# Altium project Top_Main.PrjPcb
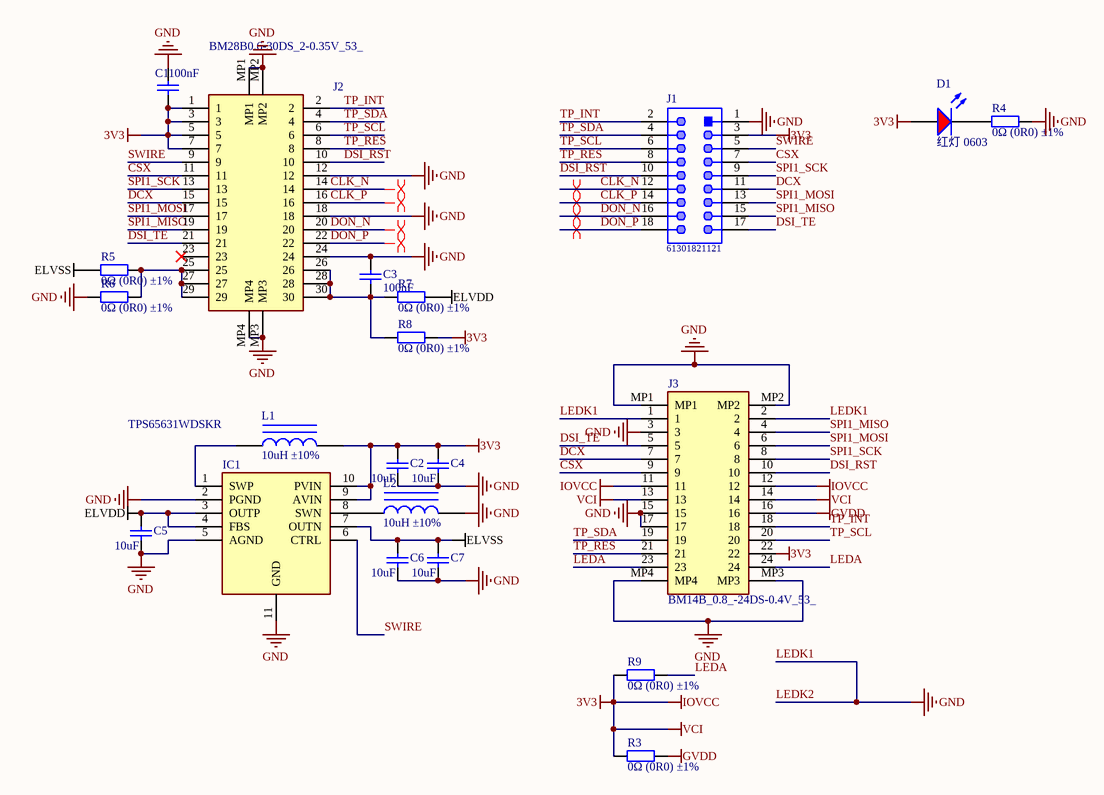
[diagram p0: MIAN.SchDoc]
1 sheet, 21 parts. Net scope: global (net labels, ports and power ports of the same name join across sheets).
Board file: PCB.PcbDoc

## Sheet MIAN.SchDoc
size A4; SheetNumber: 1; SheetTotal: 1

### Parts
C1  100nF  [0402_C]
C2  10uF  [0402_C]
C3  100nF  [0402_C]
C4  10uF  [0402_C]
C5  10uF  [0402_C]
C6  10uF  [0402_C]
C7  10uF  [0402_C]
D1  红灯 0603  [0603_LED_S1]
IC1  TPS65631WDSKR  [SON50P250X250X80-11N-D]
J1  61301821121  [61301821121]
J2  BM28B0.6-30DS_2-0.35V_53_  [BM28B0630DS2035V53]
J3  BM14B_0.8_-24DS-0.4V_53_  [BM14B0824DS04V53]
L1  10uH ±10%  [0805_L]
L2  10uH ±10%  [0805_L]
R3  0Ω (0R0) ±1%  [0402_R]
R4  0Ω (0R0) ±1%  [0402_R]
R5  0Ω (0R0) ±1%  [0402_R]
R6  0Ω (0R0) ±1%  [0402_R]
R7  0Ω (0R0) ±1%  [0402_R]
R8  0Ω (0R0) ±1%  [0402_R]
R9  0Ω (0R0) ±1%  [0402_R]

### Nets
3V3: C1.1 C2.2 C4.2 D1.A IC1.9(AVIN) IC1.10(PVIN) J1.3 J2.1 J2.3 J2.5 J2.7 J3.11 J3.12 J3.13 J3.14 J3.22 L1.2 R3.1 R8.2 R9.1  [also labelled IOVCC, VCI]
ELVDD: C5.2 IC1.3(OUTP) IC1.4(FBS) R7.2
ELVSS: C6.2 C7.2 IC1.7(OUTN) R5.1
GVDD: J3.16 R3.2
LEDK1: C1.2 C2.1 C3.1 C4.1 C5.1 C6.1 C7.1 IC1.2(PGND) IC1.5(AGND) IC1.11(GND) J1.1 J2.12 J2.18 J2.24 J2.MP1 J2.MP2 J2.MP3 J2.MP4 J3.1 J3.2 J3.3 J3.15 J3.17 J3.MP1 J3.MP2 J3.MP3 J3.MP4 L2.2 R4.2 R6.1  [also labelled GND, LEDK2]
CLK_N: J1.12 J2.14
CLK_P: J1.14 J2.16
CSX: J1.7 J2.11 J3.9
DCX: J1.11 J2.15 J3.7
DON_N: J1.16 J2.20
DON_P: J1.18 J2.22
DSI_RST: J1.10 J2.10 J3.10
DSI_TE: J1.17 J2.21 J3.5
LEDA: J3.23 J3.24 R9.2
SPI1_MISO: J1.15 J2.19 J3.4
SPI1_MOSI: J1.13 J2.17 J3.6
SPI1_SCK: J1.9 J2.13 J3.8
SWIRE: IC1.6(CTRL) J1.5 J2.9
TP_INT: J1.2 J2.2 J3.18
TP_RES: J1.8 J2.8 J3.21
TP_SCL: J1.6 J2.6 J3.20
TP_SDA: J1.4 J2.4 J3.19
NetC3_2: C3.2 J2.26 J2.28 J2.30 R7.1 R8.1
NetD1_K: D1.K R4.1
NetIC1_1: IC1.1(SWP) L1.1
NetIC1_8: IC1.8(SWN) L2.1
NetJ2_25: J2.25 J2.27 J2.29 R5.2 R6.2

Not connected (* = marked no-connect by the designer): J2 23*

### Layout directives
differential pair: CLK_N, CLK_P, DON_N, DON_P

### Library data of the parts
C1 C3 = CAP: Capacitor; Value: 100pF; Published: 8-Jun-2000; Revision: July-2002: Re-released for DXP Platform.; Publisher: Altium Limited
C2 C4-C7 = 0402 10uF (106) 20% 6.3V: 贴片电容; ComponentLink1Description: 供应商链接; ComponentLink1URL: http://www.szlcsc.com/product/details_16204.html; Package: 0402; Supplier: LC; SuppliersPartNumber: C15525
D1 = 0603 红灯: 发光二极管; ComponentLink1Description: 供应商链接; ComponentLink1URL: http://www.szlcsc.com/product/details_2659.html; Package: 0603; Supplier: LC; SuppliersPartNumber: C2286
IC1 = TPS65631WDSKR: Integrated Circuit; Manufacturer_Name: Texas Instruments; Datasheet Link: http://www.ti.com/lit/gpn/tps65631w; Height: 0.8mm; Manufacturer_Part_Number: TPS65631WDSKR; Mouser Part Number: 595-TPS65631WDSKR; Mouser Price/Stock: https://www.mouser.co.uk/ProductDetail/Texas-Instruments/TPS65631WDSKR?qs=6E8igxPflKf9wUn%252Bq%252B8X1Q%3D%3D; Arrow Part Number: TPS65631WDSKR; Arrow Price/Stock: https://www.arrow.com/en/products/tps65631wdskr/texas-instruments
J1 = CMP-1502-01101-1: THT Vertical Pin Header WR-PHD, Pitch 2.54 mm, Dual Row, 18 pins; Manufacturer: Wurth Elektronik; Withstanding Voltage: 500VAC; Pin Number: 18; Pitch: 2.54mm; Rated Current: 3A; Contact Resistance: 20mOhm; Gender: Male; Working Voltage: 250VAC; Publisher: WurthElektronik; Packaging: Bag; Row Number: Dual; Datasheet URL: https://katalog.we-online.de/em/datasheet/6130xx21121.pdf; Mounting Technology: THT; Orientation: Vertical; Part Number: 61301821121; Package Reference: 61301821121; Manufacturer URL: http://www.we-online.de; Operating Temperature: -40to105degC
J2 = BM28B0.6-30DS_2-0.35V_53_: Connector; Manufacturer_Name: Hirose; Manufacturer_Part_Number: BM28B0.6-30DS/2-0.35V(53); Datasheet Link: https://datasheet.datasheetarchive.com/originals/distributors/DKDS-30/589689.pdf; Height: 0.6mm; Mouser Part Number: 798-28B0630DS2035V53; Mouser Price/Stock: https://www.mouser.co.uk/ProductDetail/Hirose-Connector/BM28B06-30DS-2-035V53?qs=1mbolxNpo8dyGYNDVauvGQ%3D%3D
J3 = BM14B_0.8_-24DS-0.4V_53_: Connector; Manufacturer_Name: Hirose; Manufacturer_Part_Number: BM14B(0.8)-24DS-0.4V(53); Datasheet Link: https://www.arrow.com/en/products/bm14b-0.8-24ds-0.4v-53/hirose-electric; Height: 0.8mm; Mouser Part Number: 798-BM14B0824DS04V53; Mouser Price/Stock: https://www.mouser.co.uk/ProductDetail/Hirose-Connector/BM14B08-24DS-04V53?qs=QRVci0nWsCaR3TeKMbLD%252Bw%3D%3D; Arrow Part Number: BM14B(0.8)-24DS-0.4V(53); Arrow Price/Stock: https://www.arrow.com/en/products/bm14b-0.8-24ds-0.4v-53/hirose-electric
L1 L2 = 0805 10uH 10%: 贴片电感; ComponentLink1Description: 供应商链接; ComponentLink1URL: http://www.szlcsc.com/product/details_1398.html; Package: 0805; Supplier: LC; SuppliersPartNumber: C1046
R3-R9 = 0402 0Ω (0R0) 1%: 贴片电阻; ComponentLink1Description: 供应商链接; ComponentLink1URL: http://www.szlcsc.com/product/details_17853.html; Package: 0402; Supplier: LC; SuppliersPartNumber: C17168